# Altium schematic sheet 10_USB_Ethernet.SchDoc: USB Ethernet
size A3; Organization: Lime Microsystems; Address1: Surrey Tech Centre; Address2: Guildford GU2 7YG; Address3: Surrey; Address4: United Kingdom; Revision: v2.1; SheetNumber: 10; SheetTotal: 15; PageSetup: Record=PageOptions|CenterHorizontal=True|CenterVertical=True|PrintScale=1.01|XCorrection=1.00|YCorrection=1.00|PrintKind=0|BorderSize=5000000|LeftOffset=0|BottomOffset=0|Orientation=2|PaperLength=1000|PaperWidth=1000|Scale=100|PaperSource=257|PrintQuality=600|MediaType=1|DitherType=10|PrintScaleMode=1|PaperKind=A3|PaperIndex=8
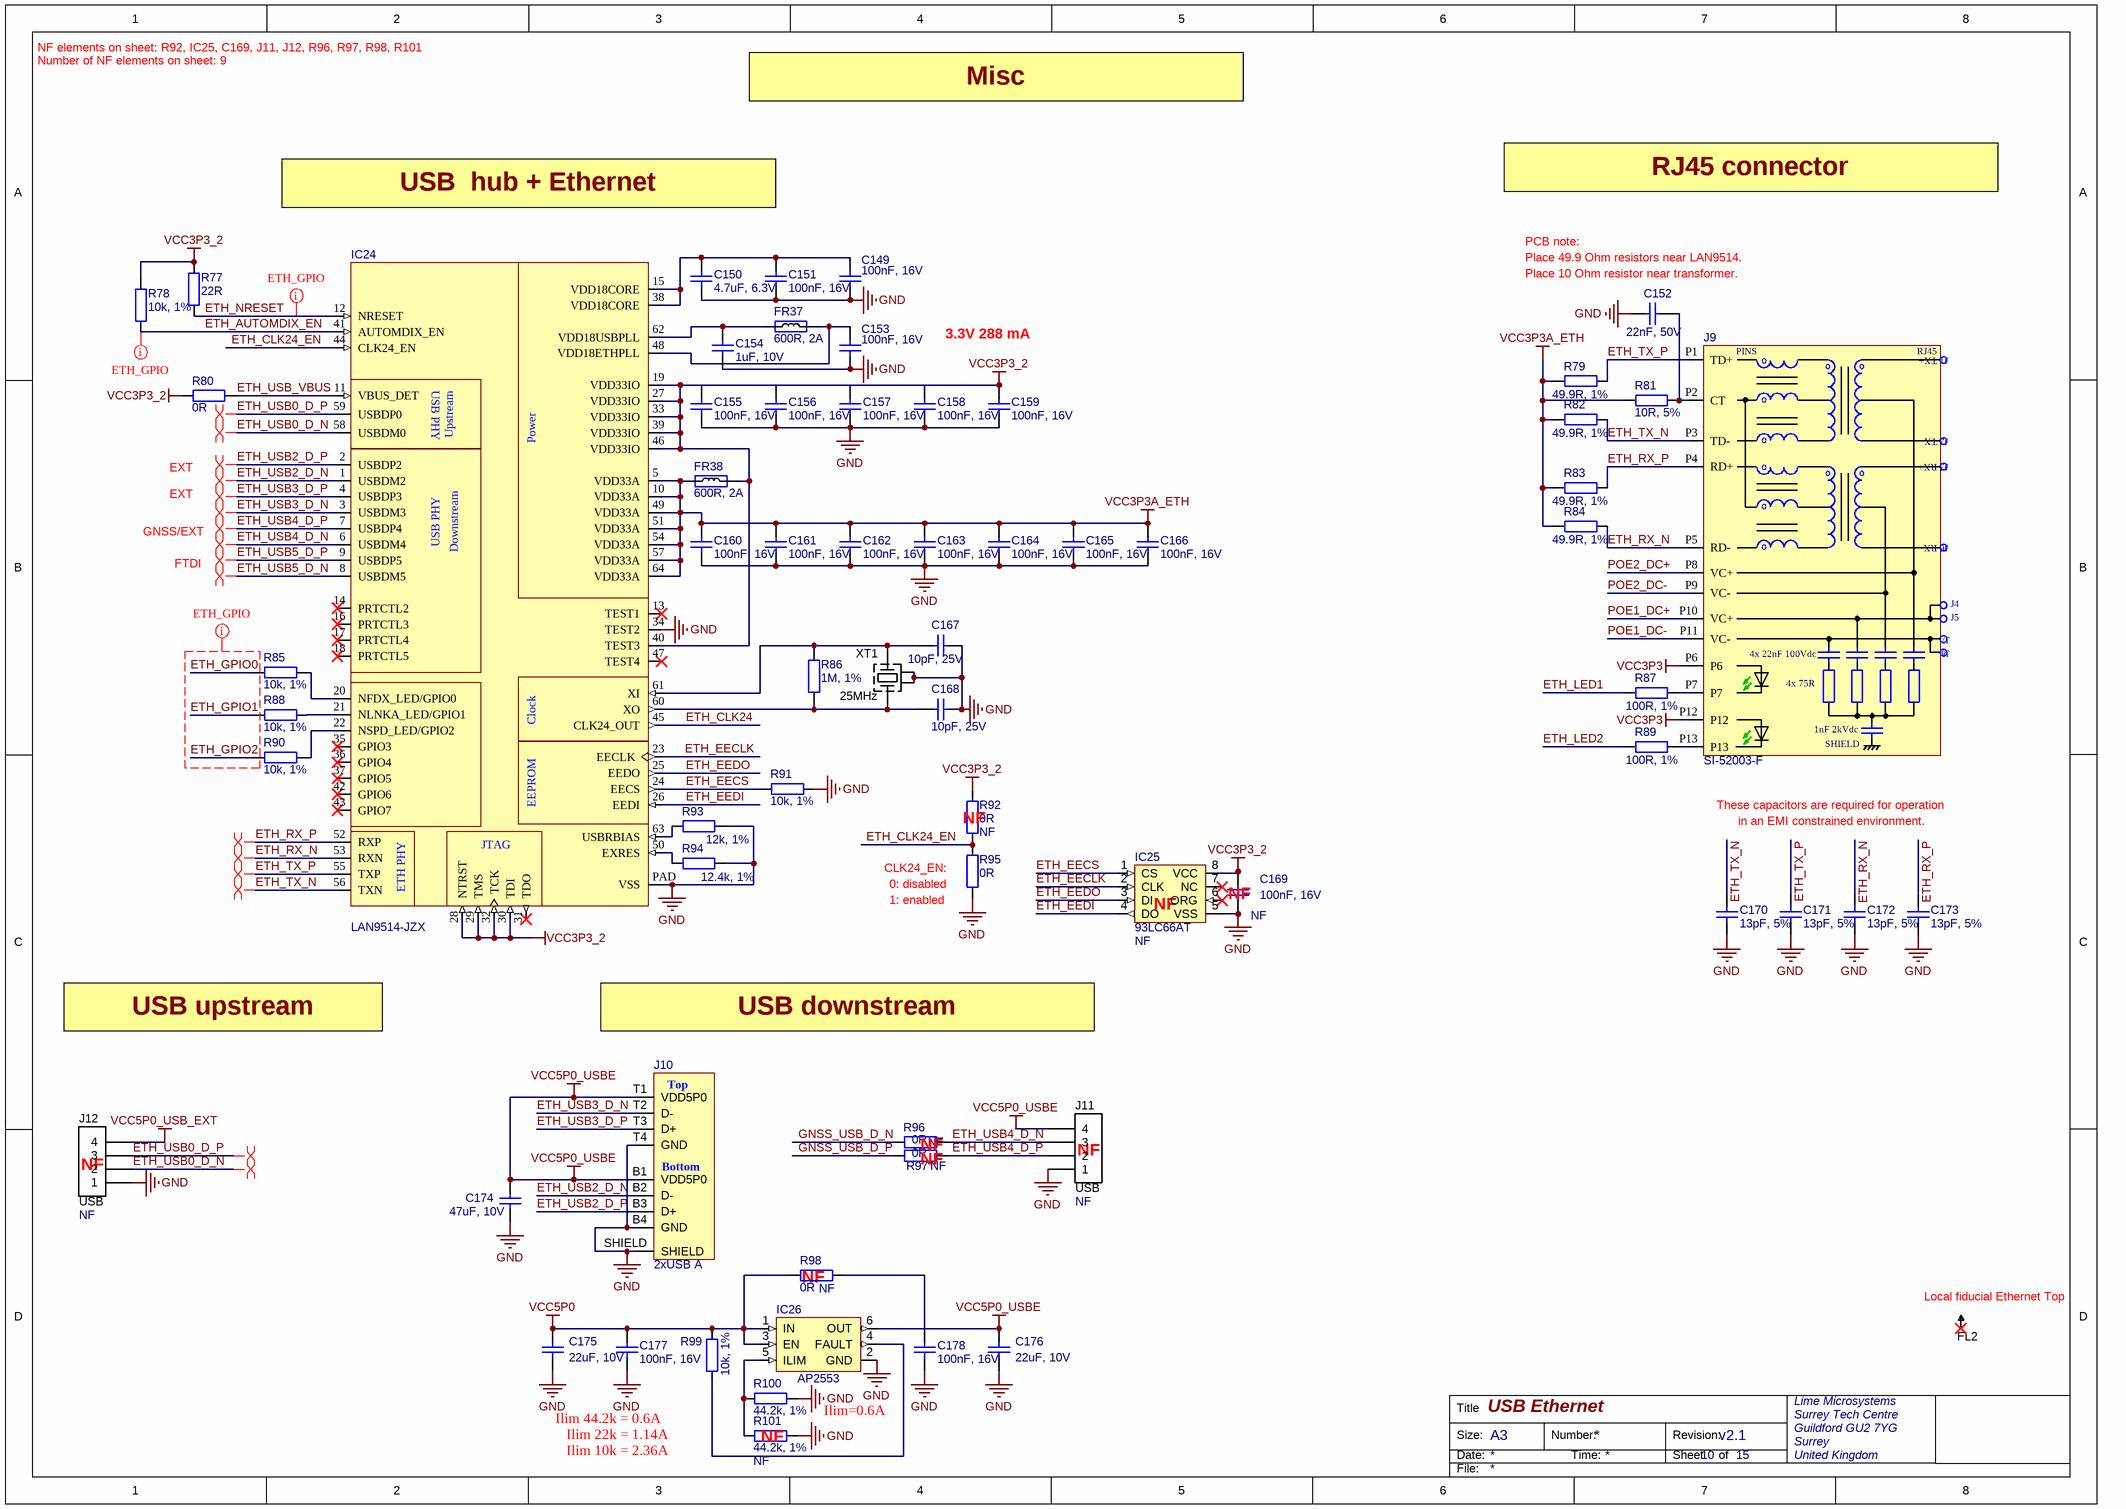
[diagram p0: 10_USB_Ethernet.SchDoc]

## Parts
C149  100nF, 16V  [CAP0402]
C150  4.7uF, 6.3V  [CAP0402]
C151  100nF, 16V  [CAP0402]
C152  22nF, 50V  [CAP0402]
C153  100nF, 16V  [CAP0402]
C154  1uF, 10V  [CAP0402]
C155  100nF, 16V  [CAP0402]
C156  100nF, 16V  [CAP0402]
C157  100nF, 16V  [CAP0402]
C158  100nF, 16V  [CAP0402]
C159  100nF, 16V  [CAP0402]
C160  100nF, 16V  [CAP0402]
C161  100nF, 16V  [CAP0402]
C162  100nF, 16V  [CAP0402]
C163  100nF, 16V  [CAP0402]
C164  100nF, 16V  [CAP0402]
C165  100nF, 16V  [CAP0402]
C166  100nF, 16V  [CAP0402]
C167  10pF, 25V  [CAP0402]
C168  10pF, 25V  [CAP0402]
C169  100nF, 16V  Assembly Info: NF  [CAP0402]
C170  13pF, 5%  [CAP0402]
C171  13pF, 5%  [CAP0402]
C172  13pF, 5%  [CAP0402]
C173  13pF, 5%  [CAP0402]
C174  47uF, 10V  [CAP1206]
C175  22uF, 10V  [CAP0603]
C176  22uF, 10V  [CAP0603]
C177  100nF, 16V  [CAP0402]
C178  100nF, 16V  [CAP0402]
FL2  Fiducial  [Fiducial_local]  (value not drawn)
FR37  600R, 2A  [RES0805]
FR38  600R, 2A  [RES0805]
IC24  LAN9514-JZX  [LAN9514I-JZX_QFN50P900X900X100-65N]
IC25  93LC66AT  Assembly Info: NF  [SOIC127P600-8DL_v2]
IC26  AP2553  [SOT23-6]
J9  SI-52003-F  [RJ45_SI-52003-F]
J10  2xUSB A  [USB_typeA_double_USBR-A-D-F-O-TH]
J11  USB  Assembly Info: NF  [HEADER4X1_TH]
J12  USB  Assembly Info: NF  [HEADER4X1_TH]
R77  22R  [RES0402]
R78  10k, 1%  [RES0402]
R79  49.9R, 1%  [RES0402]
R80  0R  [RES0402]
R81  10R, 5%  [RES0402]
R82  49.9R, 1%  [RES0402]
R83  49.9R, 1%  [RES0402]
R84  49.9R, 1%  [RES0402]
R85  10k, 1%  [RES0402]
R86  1M, 1%  [RES0402]
R87  100R, 1%  [RES0402]
R88  10k, 1%  [RES0402]
R89  100R, 1%  [RES0402]
R90  10k, 1%  [RES0402]
R91  10k, 1%  [RES0402]
R92  0R  Assembly Info: NF  [RES0402]
R93  12k, 1%  [RES0402]
R94  12.4k, 1%  [RES0402]
R95  0R  [RES0402]
R96  0R  Assembly Info: NF  [RES0402]
R97  0R  Assembly Info: NF  [RES0402]
R98  0R  Assembly Info: NF  [RES0402_v2]
R99  10k, 1%  [RES0402]
R100  44.2k, 1%  [RES0402]
R101  44.2k, 1%  Assembly Info: NF  [RES0402]
XT1  25MHz  [CRYSTAL_4-LCC]

## Nets
GND: C149.2 C150.1 C151.2 C152.1 C153.2 C154.1 C155.2 C156.2 C157.2 C158.2 C159.2 C160.2 C161.2 C162.2 C163.2 C164.2 C165.2 C166.2 C167.1 C168.1 C169.2 C170.2 C171.2 C172.2 C173.2 C174.1 C175.1 C176.1 C177.2 C178.2 IC24.34(TEST2) IC24.PAD(VSS) IC25.5(VSS) IC26.2(GND) J10.B4(GND) J10.SHIELD J10.T4(GND) J11.1 J12.1 R91.1 R93.2 R94.2 R95.2 R100.2 R101.2 XT1.2(GND) XT1.4(GND)
VCC3P3: J9.P6 J9.P12
VCC3P3_2: C155.1 C156.1 C157.1 C158.1 C159.1 C169.1 FR38.2 IC24.19(VDD33IO) IC24.27(VDD33IO) IC24.28(NTRST) IC24.29(TMS) IC24.30(TDI) IC24.32(TCK) IC24.33(VDD33IO) IC24.39(VDD33IO) IC24.40(TEST3) IC24.46(VDD33IO) IC25.8(VCC) R77.2 R78.2 R80.1 R92.1
VCC3P3A_ETH: C160.1 C161.1 C162.1 C163.1 C164.1 C165.1 C166.1 FR38.1 IC24.5(VDD33A) IC24.10(VDD33A) IC24.49(VDD33A) IC24.51(VDD33A) IC24.54(VDD33A) IC24.57(VDD33A) IC24.64(VDD33A) R79.2 R81.1 R82.2 R83.2 R84.2
VCC5P0: C175.2 C177.1 IC26.1(IN) IC26.3(EN) R98.2 R99.1
VCC5P0_USB_EXT: J12.4
VCC5P0_USBE: C174.2 C176.2 C178.1 IC26.6(OUT) J10.B1(VDD5P0) J10.T1(VDD5P0) J11.4 R98.1
ETH_AUTOMDIX_EN: IC24.41(AUTOMDIX_EN) R78.1
ETH_CLK24: IC24.45(CLK24_OUT)
ETH_CLK24_EN: IC24.44(CLK24_EN) R92.2 R95.1
ETH_EECLK: IC24.23(EECLK) IC25.2(CLK)
ETH_EECS: IC24.24(EECS) IC25.1(CS) R91.2
ETH_EEDI: IC24.26(EEDI) IC25.4(DO)
ETH_EEDO: IC24.25(EEDO) IC25.3(DI)
ETH_GPIO0: R85.2
ETH_GPIO1: R88.2
ETH_GPIO2: R90.2
ETH_LED1: R87.1
ETH_LED2: R89.1
ETH_NRESET: IC24.12(NRESET) R77.1
ETH_RX_N: C172.1 IC24.53(RXN) J9.P5(RD-) R84.1
ETH_RX_P: C173.1 IC24.52(RXP) J9.P4(RD+) R83.1
ETH_TX_N: C170.1 IC24.56(TXN) J9.P3(TD-) R82.1
ETH_TX_P: C171.1 IC24.55(TXP) J9.P1(TD+) R79.1
ETH_USB0_D_N: IC24.58(USBDM0) J12.2
ETH_USB0_D_P: IC24.59(USBDP0) J12.3
ETH_USB2_D_N: IC24.1(USBDM2) J10.B2(D-)
ETH_USB2_D_P: IC24.2(USBDP2) J10.B3(D+)
ETH_USB3_D_N: IC24.3(USBDM3) J10.T2(D-)
ETH_USB3_D_P: IC24.4(USBDP3) J10.T3(D+)
ETH_USB4_D_N: IC24.6(USBDM4) J11.3 R96.1
ETH_USB4_D_P: IC24.7(USBDP4) J11.2 R97.1
ETH_USB5_D_N: IC24.8(USBDM5)
ETH_USB5_D_P: IC24.9(USBDP5)
ETH_USB_VBUS: IC24.11(VBUS_DET) R80.2
GNSS_USB_D_N: R96.2
GNSS_USB_D_P: R97.2
POE1_DC+: J9.P10(VC+)
POE1_DC-: J9.P11(VC-)
POE2_DC+: J9.P8(VC+)
POE2_DC-: J9.P9(VC-)
NetC149_1: C149.1 C150.2 C151.1 IC24.15(VDD18CORE) IC24.38(VDD18CORE)
NetC152_2: C152.2 J9.P2(CT) R81.2
NetC153_1: C153.1 FR37.2 IC24.48(VDD18ETHPLL)
NetC154_2: C154.2 FR37.1 IC24.62(VDD18USBPLL)
NetC167_2: C167.2 IC24.61(XI) R86.1 XT1.1(X)
NetC168_2: C168.2 IC24.60(XO) R86.2 XT1.3(X)
NetIC24_20: IC24.20(NFDX_LED/GPIO0) R85.1
NetIC24_21: IC24.21(NLNKA_LED/GPIO1) R88.1
NetIC24_22: IC24.22(NSPD_LED/GPIO2) R90.1
NetIC24_50: IC24.50(EXRES) R94.1
NetIC24_63: IC24.63(USBRBIAS) R93.1
NetIC26_4: IC26.4(FAULT) R99.2
NetIC26_5: IC26.5(ILIM) R100.1 R101.1
NetJ9_P7: J9.P7 R87.2
NetJ9_P13: J9.P13 R89.2

Not connected (* = marked no-connect by the designer): FL2 1*; IC24 13(TEST1)* 14(PRTCTL2)* 16(PRTCTL3)* 17(PRTCTL4)* 18(PRTCTL5)* 31(TDO)* 35(GPIO3)* 36(GPIO4)* 37(GPIO5)* 42(GPIO6)* 43(GPIO7)* 47(TEST4)*; IC25 6(ORG)* 7(NC)*

## Layout directives
differential pair: ETH_RX_N, ETH_RX_P, ETH_TX_N, ETH_TX_P, ETH_USB0_D_N, ETH_USB0_D_P, ETH_USB2_D_N, ETH_USB2_D_P, ETH_USB3_D_N, ETH_USB3_D_P, ETH_USB4_D_N, ETH_USB4_D_P, ETH_USB5_D_N, ETH_USB5_D_P
net class ETH_GPIO: ETH_AUTOMDIX_EN, ETH_GPIO0, ETH_GPIO1, ETH_GPIO2, ETH_NRESET

## Notes on the sheet
- NF elements on sheet: R92, IC25, C169, J11, J12, R96, R97, R98, R101
- Number of NF elements on sheet: 9
- Misc
- USB  hub + Ethernet
- RJ45 connector
- PCB note:
- (near C152) Place 49.9 Ohm resistors near LAN9514.
- (near C152) Place 10 Ohm resistor near transformer.
- 3.3V 288 mA
- EXT
- GNSS/EXT
- FTDI
- (near R92) NF
- These capacitors are required for operation
- in an EMI constrained environment.
- CLK24_EN:
- (near R95) 0: disabled
- (near R95) 1: enabled
- (near IC25) NF
- (near C169) NF
- USB upstream
- USB downstream
- (near J12) NF
- (near R97) NF
- NF
- (near J11) NF
- (near R98) NF
- (near FL2) Local fiducial Ethernet Top
- Ilim 44.2k = 0.6A
- Ilim 22k = 1.14A
- Ilim 10k = 2.36A
- (near R101) NF
- Ilim=0.6A
- Title
- Size:
- Date:
- A3
- Number:
- Time:
- Revision:
- Sheet
- of
- File:
- (in symbol LAN9514-JZX-TR) USB PHY; Upstream; Power; Downstream; Clock; EEPROM; JTAG; ETH PHY
- (in symbol RJ45_SI-52003-F) PINS; J1 TX+; J2 TX-; J3 RX+; J6 RX-; J4; J5; J7; J8; 4x 22nF 100Vdc; 4x 75R; 1nF 2kVdc; SHIELD
- (in symbol USB_typeA_double_USBR-A-D-F-O-TH) Top; Bottom

## Library data of the parts
C149 C151 C153 C155-C166 C169 C177 C178 = Cap_0402: Manufacturer: Murata Electronics; Manufacturer Part Number: GRM155R71C104KA88D; Part Description: CAP CER 0.1UF 16V X7R 0402; Tolerance: 10 %; Type: General Purpose MLCC; Capacitance: 0.1 uF; Case Length: 1 mm; Dielectric: X7R; Case Height: 0.5 mm; Temperature Coefficient / Code: +/- 15 %; Value: 100nF, 16V; Supplier 1: Mouser; Supplier Part Number 1: 81-GRM155R71C104KA88; Case Code - in: 0402; RoHS: RoHS Compliant; Operating Temperature Range: - 55 C to + 125 C; Series: GRM; Termination Style: SMD/SMT; Package / Case: 0402 (1005 metric); Voltage Rating DC: 16 V; Maximum Operating Temperature: + 125 C; Case Code - mm: 1005; Minimum Operating Temperature: - 55 C; Product Category: Low & Medium Capacitance SMD Ceramic Chip Capacitors; Packaging: Reel; Product: General Type MLCCs; Category: Multilayer Ceramic Capacitors MLCC - SMD/SMT; Brand: Murata Electronics; Case Width: 0.5 mm; RoHS - Mouser: Y; Standard Pack Qty: 10000; Minimum Order Quantity: 1; Reeling: True; Manufacturer Part Number 1: GRM155R71C104KA88D
C150 = Cap_0402: Manufacturer: Murata Electronics North America; Manufacturer Part Number 1: GRM155R60J475ME87D; Part Description: 4.7µF ±20% 6.3V X5R Ceramic Capacitor -55°C ~ 85°C Surface Mount, MLCC 0402 (1005 Metric) 0.039" L x 0.020" W (1.00mm x 0.50mm); Tolerance: ±20%; Capacitance: 4.7µF; Temperature Coefficient: X5R; Lead Style: -; Ratings: -; Height - Seated (Max): -; Thickness (Max): 0.022" (0.55mm); Voltage - Rated: 6.3V; Packaging: Cut Tape (CT); Lead Spacing: -; Category: Capacitors; Supplier Part Number 1: 490-5408-1-ND; Applications: General Purpose; Operating Temperature: -55°C ~ 85°C; Mounting Type: Surface Mount, MLCC; Features: Derating Recommended; RoHS: RoHS Compliant; Supplier 1: Digi-Key; Package / Case: 0402 (1005 Metric); Size / Dimension: 0.039" L x 0.020" W (1.00mm x 0.50mm); Value: 4.7uF, 6.3V
C152 = Cap_0402: Manufacturer: Kemet; Manufacturer Part Number 1: C0402C223K5RACTU; Part Description: 0.022µF ±10% 50V Ceramic Capacitor X7R 0402 (1005 Metric); Temperature Coefficient: X7R; Tolerance: ±10%; Capacitance: 0.022µF; Value: 22nF, 50V; Supplier 1: Digi-Key; Supplier Part Number 1: 399-7780-1-ND; Ratings: -; Packaging: Cut Tape (CT); Category: Capacitors; Size / Dimension: 0.039" L x 0.020" W (1.00mm x 0.50mm); RoHS: RoHS Compliant; Operating Temperature: -55°C ~ 125°C; Mounting Type: Surface Mount, MLCC; Applications: General Purpose; Voltage - Rated: 50V; Thickness (Max): 0.022" (0.55mm); Features: -; Height - Seated (Max): -; Lead Style: -; Package / Case: 0402 (1005 Metric); Lead Spacing: -
C154 = Cap_0402: CAP CER 1UF 10V X5R 0402; Manufacturer: Yageo; Part Description: 1µF 10V Ceramic Capacitor X5R 0402 (1005 Metric) 0.039" L x 0.020" W (1.00mm x 0.50mm); Manufacturer Part Number 1: CC0402MRX5R6BB105; Notification: Current market demand for these product types have resulted in fluctuating and extending lead times. Lead times may differ.; Tolerance: ±20%; Value: 1uF, 10V; Supplier 1: Digi-Key; Supplier Part Number 1: 311-1732-1-ND; RoHS: RoHS Compliant; Applications: General Purpose; Category: Capacitors; ComponentLink1Description: http://www.yageo.com/documents/recent/UPY-GPHC_X5R_4V-to-50V_25.pdf; ComponentLink1URL: http://www.yageo.com/documents/recent/UPY-GPHC_X5R_4V-to-50V_25.pdf; Failure Rate: -; Features: -; Height - Seated (Max): -; Lead Spacing: -; Lead Style: -; Mounting Type: Surface Mount, MLCC; Operating Temperature: -55°C ~ 85°C; Package / Case: 0402 (1005 Metric); Packaging: Cut Tape (CT); Part Status: Active; Pricing 1: 1=0.22, 10=0.156, 100=0.0732, 500=0.0513, 1000=0.04248, 2500=0.03953, 5000=0.03617 (USD); Ratings: -; Size / Dimension: 0.039" L x 0.020" W (1.00mm x 0.50mm); Stock 1: 69600; Temperature Coefficient: X5R; Thickness (Max): 0.022" (0.55mm); Voltage - Rated: 10V
C167 C168 = Cap_0402: Manufacturer: AVX; Part Description: 10pF ±5% 25V C0G, NP0 Ceramic Capacitor -55°C ~ 125°C Surface Mount, MLCC 0402 (1005 Metric) 0.039" L x 0.020" W (1.00mm x 0.50mm); Manufacturer Part Number 1: 04023A100JAT2A; Capacitance: 10; Ceramic Capacitor Case: 0402 [1005 Metric]; Capacitance Tolerance: ± 5%; Capacitor Case Style: 0402 [1005 Metric]<!--FANDB--><div class="features-and-benefits-container"></div>; Dielectric Characteristic: C0G / NP0; SVHC: No SVHC (16-Jun-2014); Voltage Rating: 25; Supplier 1: Farnell; Supplier Part Number 1: 2332478RL; value: 10pF, 25V; Capacitance Tolerance ±: ± 5%; MSL: MSL 1 - Unlimited; Operating Temperature Max: 125; Operating Temperature Min: -55; Packaging: Cut Tape; Product Range: -; RoHS: YES
C170-C173 = Cap_0603: Manufacturer: Murata Electronics North America; Part Description: 13pF ±5% 50V C0G, NP0 Ceramic Capacitor -55°C ~ 125°C Surface Mount, MLCC 0402 (1005 Metric) 0.039" L x 0.020" W (1.00mm x 0.50mm); Manufacturer Part Number 1: GRM1555C1H130JA01D; Voltage - Rated: 50V; Supplier 1: Digi-Key; Supplier Part Number 1: 490-5925-2-ND; Tolerance: ±5%; Capacitance: 13pF; Category: Capacitors; Package / Case: 0402 (1005 Metric); Value: 13pF, 5%
C174 = Cap_1206: Manufacturer: TDK Corporation; Manufacturer Part Number 1: C3216X6S1A476M160AC; Part Description: 47µF ±20% 10V Ceramic Capacitor X6S 1206 (3216 Metric); Notification: Current market demand for these product types have resulted in fluctuating and extending lead times. Lead times may differ.; Tolerance: ±20%; Temperature Coefficient: X6S; Value: 47uF, 10V; RoHS: RoHS Compliant; Packaging: Cut Tape (CT); Operating Temperature: -55°C ~ 105°C; Voltage - Rated: 10V; Height - Seated (Max): -; Ratings: -; Applications: General Purpose; Features: Low ESL; Size / Dimension: 0.126" L x 0.063" W (3.20mm x 1.60mm); Supplier 1: Digi-Key; Lead Spacing: -; Supplier Part Number 1: 445-6010-1-ND; Thickness (Max): 0.071" (1.80mm); Failure Rate: -; Category: Capacitors; Lead Style: -; Part Status: Active; Mounting Type: Surface Mount, MLCC; Package / Case: 1206 (3216 Metric)
C175 C176 = Cap_0603: Manufacturer Part Number 1: C1608X5R1A226M080AC; Manufacturer: TDK Corporation; Part Description: 22µF ±20% 10V X5R Ceramic Capacitor -55°C ~ 85°C Surface Mount, MLCC 0603 (1608 Metric) 0.063" L x 0.031" W (1.60mm x 0.80mm); Brand: TDK; Temperature Coefficient / Code: +/- 15 %; Tolerance: 20 %; Type: Multilayer Ceramic Chip Capacitor; Supplier 1: Mouser; Supplier Part Number 1: 810-C1608X5R1A226M; Package / Case: 0603 (1608 metric); Category: Multilayer Ceramic Capacitors MLCC - SMD/SMT; Capacitance: 22 uF; Operating Temperature Range: - 55 C to + 85 C; Case Code - in: 0603; Voltage Rating DC: 10 V; Case Code - mm: 1608; Value: 22uF, 10V
FR37 FR38 = Ferrite: Manufacturer Part Number 1: MPZ2012S601AT000; Manufacturer: TDK Corporation; Part Description: FERRITE BEAD 600 OHM 0805 1LN; Filter Type: Differential Mode - Single; Impedance @ Frequency: 600 Ohm @ 100MHz; DC Resistance (DCR): 100 mOhm Max; Supplier 1: Digi-Key; Supplier Part Number 1: 445-2206-2-ND; Mounting Type: Surface Mount; RoHS: RoHS Compliant; Height (Max): 0.041" (1.05mm); Packaging: Tape & Reel (TR); Category: Filters; Current Rating: 2A; Package / Case: 0805 (2012 Metric); Size / Dimension: 0.079" L x 0.049" W (2.00mm x 1.25mm); Value: 600R, 2A
IC24 = LAN9514-JZX-TR: Part Description: Ethernet Bridge, USB to Ethernet USB 2.0, 10/100 Base-T/TX PHY USB Interface 64-QFN (9x9; Manufacturer: Microchip Technology; Protocol: Ethernet; Function: Bridge, USB to Ethernet; Interface: USB; Standards: USB 2.0, 10/100 Base-T/TX PHY; Voltage - Supply: 1.8V, 3.3V; Current - Supply: 288mA; Supplier 1: Digi-Key; Manufacturer Part Number 1: LAN9514-JZX-TR; RoHS: RoHS Compliant; Category: Integrated Circuits (ICs); Stock 1: 3000; Pricing 1: 1=5.84, 25=4.8616, 100=4.8363 (USD); Packaging: Digi-Reel®; Part Status: Active; Operating Temperature: 0°C ~ 70°C; Package / Case: 64-VFQFN Exposed Pad; Supplier Device Package: 64-QFN (9x9); Base Part Number: LAN9514; ComponentLink1URL: http://www.microchip.com/mymicrochip/filehandler.aspx?ddocname=en562340; ComponentLink1Description: http://www.microchip.com/mymicrochip/filehandler.aspx?ddocname=en562340; Supplier Part Number 1: LAN9514-JZX-DKR-ND
IC25 = 93LC66AT-I/SN_EEPROM: Part Description: EEPROM Memory IC 4Kb (512 x 8) SPI 2MHz 8-SOIC; Manufacturer: Microchip Technology; Memory Type: Non-Volatile; Memory Format: EEPROM; Memory Size: 4Kb (512 x 8); Write Cycle Time - Word, Page: 6ms; Memory Interface: SPI; Voltage - Supply: 2.5 V ~ 5.5 V; Supplier 1: Digi-Key; Manufacturer Part Number 1: 93LC66AT-I/SN; RoHS: RoHS Compliant; Category: Integrated Circuits (ICs); Stock 1: 6857; Pricing 1: 1=0.27, 25=0.2576, 100=0.2543 (USD); Packaging: Digi-Reel®; Part Status: Active; Technology: EEPROM; Operating Temperature: -40°C ~ 85°C (TA); Mounting Type: Surface Mount; Package / Case: 8-SOIC (0.154", 3.90mm Width); Supplier Device Package: 8-SOIC; ComponentLink1URL: http://www.microchip.com/mymicrochip/filehandler.aspx?ddocname=en011819; ComponentLink1Description: http://www.microchip.com/mymicrochip/filehandler.aspx?ddocname=en011819; Supplier Part Number 1: 93LC66AT-I/SNDKR-ND
IC26 = AP2553W6-7: Manufacturer: Diodes; Part Description: IC PD SW CURR LIMIT SOT26; Number of Outputs: 1; Min Supply Voltage: 2.7V; Max Supply Voltage: 5.5V; Interface: On/Off; Max Output Current: 2.1A; Turn-Off Delay Time: 500us; On-State Resistance: 70mR; Turn-On Delay Time: 1.5ms; Power Rating: 340mW; Fault Protection: Over Temperature,Reverse Current; Output Configuration: High Side; Supplier 1: Digi-Key; Manufacturer Part Number 1: AP2553W6-7; Stock 1: 53805; Pricing 1: 1=0.5, 10=0.425, 100=0.3172, 500=0.24926, 1000=0.19261 (USD); Mount: Surface Mount; Case/Package: SOT-26; Number of Pins: 6; Min Operating Temperature: -40°C; Max Operating Temperature: 85°C; Package Quantity: 3000; Packaging: Tape and Reel; Voltage: 5.5V; Current: 2.1A; Length: 3.1mm; Height: 1.3mm; Width: 1.7mm; Radiation Hardening: No; Lead Free: Lead Free; REACH SVHC: No SVHC; Supplier Part Number 1: AP2553W6-7DIDKR-ND
J9 = RJ45_SI-52003-F: Part Description: 1 Port RJ45 Magjack Connector Through Hole 10/100 Base-T, AutoMDIX, Power over Ethernet (PoE); Manufacturer: Stewart Connector; Connector Type: RJ45; LED Color: Green - Green; Number of Cores per Jack: 4; Shielding: Shielded, EMI Finger; Tab Direction: Up; Shield Material: Copper Alloy; Supplier 1: Digi-Key; Manufacturer Part Number 1: SI-52003-F; RoHS: RoHS Compliant; Category: Connectors, Interconnects; Stock 1: 11085; Pricing 1: 1=5.33, 10=5.112, 25=4.686, 50=4.473, 100=4.26, 250=3.72752, 500=3.621, 1000=3.0885, 2500=2.8755 (USD); Packaging: Tray; Part Status: Active; Applications: 10/100 Base-T, AutoMDIX, Power over Ethernet (PoE); Mounting Type: Through Hole; Orientation: 90° Angle (Right); Termination: Solder; Height Above Board: 0.550" (13.97mm); Features: Board Guide; Contact Material: Copper Alloy; Contact Finish: Gold; Operating Temperature: -; Contact Finish Thickness: 50.0µin (1.27µm); Housing Material: Thermoplastic; ComponentLink1URL: https://belfuse.com/resources/StewartConnector/SI-52003-F.pdf; ComponentLink1Description: https://belfuse.com/resources/StewartConnector/SI-52003-F.pdf; Supplier Part Number 1: 380-1119-ND
J10 = USB_typeA_double_USBR-A-D-F-O-TH: Manufacturer: Samtec; Part Description: USB - A USB 2.0 Receptacle Connector 8 Position Through Hole, Right Angle; Number of Contacts: 4; Number of Ports: 1; Max Voltage Rating (AC): 30V; Gender: Female; Supplier 1: Digi-Key; Manufacturer Part Number 1: USBR-A-D-F-O-TH; Stock 1: 2359; Pricing 1: 1=1.6, 10=1.448, 25=1.3592, 50=1.3002, 100=1.2411, 250=1.12292, 500=1.03426, 1000=0.8865, 2500=0.8274 (USD); Mount: Through Hole; Contact Material: Bronze; Contact Plating: Gold; Number of Terminals: 4; Housing Material: Thermoplastic; Min Operating Temperature: -50°C; Max Operating Temperature: 85°C; Packaging: Bulk; Termination: Solder; Orientation: Right Angle; Radiation Hardening: No; Supplier Part Number 1: SAM10376-ND
J11 J12 = Header4P: Header, 4-pin; Part Description: 4 Positions Header Connector 0.100" (2.54mm) Through Hole Gold; Manufacturer: Wurth Electronics Inc.; Manufacturer Part Number 1: 61300411121; Pitch - Mating: 0.100" (2.54mm); Number of Positions: 4; Number of Positions Loaded: All; Style: Board to Board or Cable; Shrouding: Unshrouded; Contact Length - Mating: 0.236" (6.00mm); Contact Length - Post: 0.118" (3.00mm); Overall Contact Length: 0.454" (11.54mm); Material Flammability Rating: UL94 V-0; Current Rating: 3A; Voltage Rating: 250V; Supplier 1: Digi-Key; Supplier Part Number 1: 732-5317-ND; RoHS: RoHS Compliant; Category: Connectors, Interconnects; Stock 1: 25204; Pricing 1: 1=0.18, 10=0.153, 25=0.1272, 50=0.106, 100=0.096, 1000=0.088 (USD); Packaging: Bulk; Part Status: Active; Connector Type: Header; Contact Type: Male Pin; Number of Rows: 1; Row Spacing - Mating: -; Mounting Type: Through Hole; Termination: Solder; Fastening Type: Push-Pull; Insulation Height: 0.100" (2.54mm); Contact Shape: Square; Contact Finish - Mating: Gold; Contact Finish Thickness - Mating: -; Contact Finish - Post: -; Contact Material: Copper Alloy; Insulation Material: Polybutylene Terephthalate (PBT); Features: -; Operating Temperature: -40°C ~ 125°C; Ingress Protection: -; Insulation Color: Black; Mated Stacking Heights: -; Contact Finish Thickness - Post: -; Applications: -; ComponentLink1URL: http://katalog.we-online.de/em/datasheet/6130xx11121.pdf; ComponentLink1Description: http://katalog.we-online.de/em/datasheet/6130xx11121.pdf
R77 = Res_0402: Manufacturer: Yageo; Manufacturer Part Number 1: RC0402FR-0722RL; Part Description: RES SMD 22 OHM 1% 1/16W 0402; Temperature Coefficient: ±100ppm/°C; Resistance (Ohms): 22; Tolerance: ±1%; Value: 22R; Supplier 1: Digi-Key; Supplier Part Number 1: 311-22.0LRTR-ND; Category: Resistors; Supplier Device Package: 0402; Composition: Thick Film
R78 R85 R88 R90 R91 R99 = Res_0402: Manufacturer: Yageo; Manufacturer Part Number 1: RC0402FR-0710KL; Part Description: RES SMD 10K OHM 1% 1/16W 0402; Temperature Coefficient: ±100ppm/°C; Power (Watts): 0.063W, 1/16W; Value: 10k, 1%; Supplier 1: Digi-Key; Supplier Part Number 1: 311-10.0KLRTR-ND; Resistance (Ohms): 10k; Packaging: Tape & Reel (TR); RoHS: RoHS Compliant; Package / Case: 0402 (1005 Metric); Tolerance: ±1%; Operating Temperature: -55°C ~ 155°C; Size / Dimension: 0.039" L x 0.020" W (1.00mm x 0.50mm); Number of Terminations: 2; Category: Resistors; Height: 0.016" (0.40mm); Supplier Device Package: 0402; Features: Moisture Resistant; Composition: Thick Film
R79 R82-R84 = Res_0402: Manufacturer: Samsung Electro-Mechanics America, Inc.; Part Description: RES SMD 49.9 OHM 1% 1/16W 0402; Manufacturer Part Number 1: RC1005F49R9CS; Temperature Coefficient: ±100ppm/°C; Resistance (Ohms): 49.9; Power (Watts): 0.063W, 1/16W; Number of Terminations: 2; Size / Dimension: 0.039" L x 0.020" W (1.00mm x 0.50mm); Supplier Device Package: 0402 (1005 Metric); RoHS: RoHS Compliant; Supplier Part Number 1: 1276-3469-6-ND; Features: -; Packaging: Digi-Reel®; Tolerance: ±1%; Height: 0.016" (0.40mm); Category: Resistors; Composition: Thick Film; Package / Case: 0402 (1005 Metric); Supplier 1: Digi-Key; Operating Temperature: -55°C ~ 155°C; Value: 49.9R, 1%
R80 R92 R95 R98 = Res_0402: Manufacturer Part Number 1: RC0402JR-070RL; Manufacturer: Yageo; Part Description: RES SMD 0.0OHM JUMPER 1/16W 0402; Resistance (Ohms): 0.0; Tolerance: Jumper; Power (Watts): 0.063W, 1/16W; Value: 0R; Supplier 1: Digi-Key; Supplier Part Number 1: 311-0.0JRTR-ND; Category: Resistors; Temperature Coefficient: -; Features: Moisture Resistant; Supplier Device Package: 0402; Height: 0.016" (0.40mm); Package / Case: 0402 (1005 Metric); Operating Temperature: -55°C ~ 155°C; Size / Dimension: 0.039" L x 0.020" W (1.00mm x 0.50mm); Composition: Thick Film; Packaging: Tape & Reel (TR); Number of Terminations: 2; RoHS: RoHS Compliant
R81 = Res_0402: Manufacturer Part Number 1: RC0402JR-0710RL; Manufacturer: Yageo; Part Description: RES SMD 10 OHM 5% 1/16W 0402; Power (Watts): 0.063W, 1/16W; Resistance (Ohms): 10; Temperature Coefficient: ±200ppm/°C; Value: 10R, 5%; Supplier 1: Digi-Key; Supplier Part Number 1: 311-10JRTR-ND; Number of Terminations: 2; Height: 0.016" (0.40mm); RoHS: RoHS Compliant; Composition: Thick Film; Packaging: Tape & Reel (TR); Category: Resistors; Supplier Device Package: 0402; Features: Moisture Resistant; Tolerance: ±5%; Operating Temperature: -55°C ~ 155°C; Size / Dimension: 0.039" L x 0.020" W (1.00mm x 0.50mm); Package / Case: 0402 (1005 Metric)
R86 = Res_0402: Manufacturer Part Number 1: RC0402FR-071ML; Manufacturer: Yageo; Part Description: 1 MOhms ±1% 0.063W, 1/16W Chip Resistor 0402 (1005 Metric) Moisture Resistant Thick Film; Power (Watts): 0.063W, 1/16W; Temperature Coefficient: ±100ppm/°C; Value: 1M, 1%; Package / Case: 0402 (1005 Metric); Failure Rate: -; Supplier Device Package: 0402; Tolerance: ±1%; Composition: Thick Film; Category: Resistors; Part Status: Active; Height - Seated (Max): 0.016" (0.40mm); Size / Dimension: 0.039" L x 0.020" W (1.00mm x 0.50mm); Supplier 1: Digi-Key; Operating Temperature: -55°C ~ 155°C; Supplier Part Number 1: 311-1.00MLRCT-ND; RoHS: RoHS Compliant; Features: Moisture Resistant; Packaging: Cut Tape (CT)
R87 R89 = Res_0402: Manufacturer Part Number 1: RMCF0402FT100R; Manufacturer: Stackpole Electronics Inc.; Part Description: RES SMD 100 OHM 1% 1/16W 0402; Power (Watts): 0.063W, 1/16W; Temperature Coefficient: ±100ppm/°C; Resistance (Ohms): 100; Value: 100R, 1%; Supplier 1: Digi-Key; Supplier Part Number 1: RMCF0402FT100RDKR-ND; Packaging: Digi-Reel®; Composition: Thick Film; Number of Terminations: 2; Package / Case: 0402 (1005 Metric); RoHS: RoHS Compliant; Category: Resistors; Size / Dimension: 0.039" L x 0.020" W (1.00mm x 0.50mm); Tolerance: ±1%; Supplier Device Package: 0402; Features: -; Height: 0.016" (0.40mm); Operating Temperature: -55°C ~ 155°C
R93 = Res_0402: Manufacturer: Samsung Electro-Mechanics; Manufacturer Part Number 1: RC1005F123CS; Part Description: 12 kOhms ±1% 0.063W, 1/16W Chip Resistor 0402 (1005 Metric) Moisture Resistant Thick Film; Power (Watts): 0.063W, 1/16W; Temperature Coefficient: ±100ppm/°C; Value: 12k, 1%; Operating Temperature: -55°C ~ 155°C; Height - Seated (Max): 0.016" (0.40mm); Supplier 1: Digi-Key; Packaging: Cut Tape (CT); Composition: Thick Film; Tolerance: ±1%; Category: Resistors; Part Status: Active; Failure Rate: -; Supplier Device Package: 0402; Features: Moisture Resistant; Supplier Part Number 1: 1276-4122-1-ND; RoHS: RoHS Compliant; Package / Case: 0402 (1005 Metric); Size / Dimension: 0.039" L x 0.020" W (1.00mm x 0.50mm)
R94 = Res_0402: Manufacturer Part Number 1: RT0402BRE0712K4L; Manufacturer: Yageo; Part Description: 12.4 kOhms ±0.1% 0.063W, 1/16W Chip Resistor 0402 (1005 Metric)  Thin Film; Temperature Coefficient: ±50ppm/°C; Tolerance: ±0.1%; Power (Watts): 0.063W, 1/16W; Value: 12.4k, 1%; Package / Case: 0402 (1005 Metric); RoHS: RoHS Compliant; Composition: Thin Film; Height - Seated (Max): 0.014" (0.35mm); Supplier 1: Digi-Key; Failure Rate: -; Size / Dimension: 0.039" L x 0.020" W (1.00mm x 0.50mm); Supplier Device Package: 0402; Part Status: Active; Operating Temperature: -55°C ~ 155°C; Features: -; Packaging: Cut Tape (CT); Category: Resistors; Supplier Part Number 1: YAG4337CT-ND; Part Description: RT0402BRE0712K4L; Manufacturer Part Number: RT0402BRE0712K4L
R96 R97 = Res_0402: Manufacturer: Yageo; Part Description: RES SMD 0.0OHM JUMPER 1/16W 0402; Manufacturer Part Number 1: RC0402JR-070RL; Power (Watts): 0.063W, 1/16W; Resistance (Ohms): 0.0; Tolerance: Jumper; Supplier 1: Digi-Key; Supplier Part Number 1: 311-0.0JRTR-ND; Composition: Thick Film; Package / Case: 0402 (1005 Metric); Category: Resistors; Value: 0R; Features: Moisture Resistant; Height: 0.016" (0.40mm); Number of Terminations: 2; Operating Temperature: -55°C ~ 155°C; Packaging: Tape & Reel (TR); RoHS: RoHS Compliant; Size / Dimension: 0.039" L x 0.020" W (1.00mm x 0.50mm); Supplier Device Package: 0402; Temperature Coefficient: -
R100 R101 = Res_0402: Manufacturer Part Number 1: ERJ-2RKF4422X; Manufacturer: Panasonic Electronic Components; Part Description: RES SMD 44.2K OHM 1% 1/10W 0402; Power (Watts): 0.1W, 1/10W; Temperature Coefficient: ±100ppm/°C; Value: 44.2k, 1%; Supplier 1: Digi-Key; Supplier Part Number 1: P44.2KLCT-ND; Tolerance: ±1%; Supplier Device Package: 0402; Packaging: Cut Tape (CT); Size / Dimension: 0.039" L x 0.020" W (1.00mm x 0.50mm); Features: Automotive AEC-Q200; Package / Case: 0402 (1005 Metric); Height: 0.016" (0.40mm); Operating Temperature: -55°C ~ 155°C; Number of Terminations: 2; Composition: Thick Film; Resistance (Ohms): 44.2k; RoHS: RoHS Compliant; Category: Resistors
XT1 = CRYSTAL_19M2: Oscillator Crystal 25 MHz; Manufacturer Part Number 1: ABM8-25.000MHZ-B2-T; Manufacturer: ABRACON; Part Description: 25MHz ±20ppm Crystal 18pF 50 Ohm -20°C ~ 70°C Surface Mount 4-SMD, No Lead (DFN, LCC); Supplier 1: Newark; Supplier Part Number 1: 13J1767